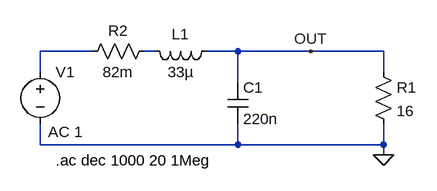
[diagram p0: schematic output_filter.asc]
output_filter.asc, the LTspice schematic file:
Version 4
SHEET 1 880 680
WIRE 0 96 -80 96
WIRE 96 96 80 96
WIRE 224 96 176 96
WIRE 336 96 224 96
WIRE 448 96 336 96
WIRE -80 128 -80 96
WIRE 448 128 448 96
WIRE 224 144 224 96
WIRE -80 240 -80 208
WIRE 224 240 224 208
WIRE 224 240 -80 240
WIRE 448 240 448 208
WIRE 448 240 224 240
WIRE 448 256 448 240
FLAG 448 256 0
FLAG 336 96 OUT
SYMBOL ind 192 80 R90
WINDOW 0 5 56 VBottom 2
WINDOW 3 32 56 VTop 2
SYMATTR InstName L1
SYMATTR Value 33µ
SYMBOL cap 208 144 R0
SYMATTR InstName C1
SYMATTR Value 220n
SYMBOL res 432 112 R0
SYMATTR InstName R1
SYMATTR Value 16
SYMBOL voltage -80 112 R0
WINDOW 123 12 108 Left 2
WINDOW 39 0 0 Left 2
SYMATTR Value2 AC 1
SYMATTR InstName V1
SYMATTR Value ""
SYMBOL res 96 80 R90
WINDOW 0 0 56 VBottom 2
WINDOW 3 32 56 VTop 2
SYMATTR InstName R2
SYMATTR Value 82m
TEXT -56 264 Left 2 !.ac dec 1000 20 1Meg

The netlist it stands for:
* output_filter.asc
L1 OUT N002 33µ
C1 OUT 0 220n
R1 OUT 0 16
V1 N001 0 AC 1
R2 N002 N001 82m
.ac dec 1000 20 1Meg
.backanno
.end